# EAGLE design WSTL18P2_SHIELD (EAGLE 7.7.0)
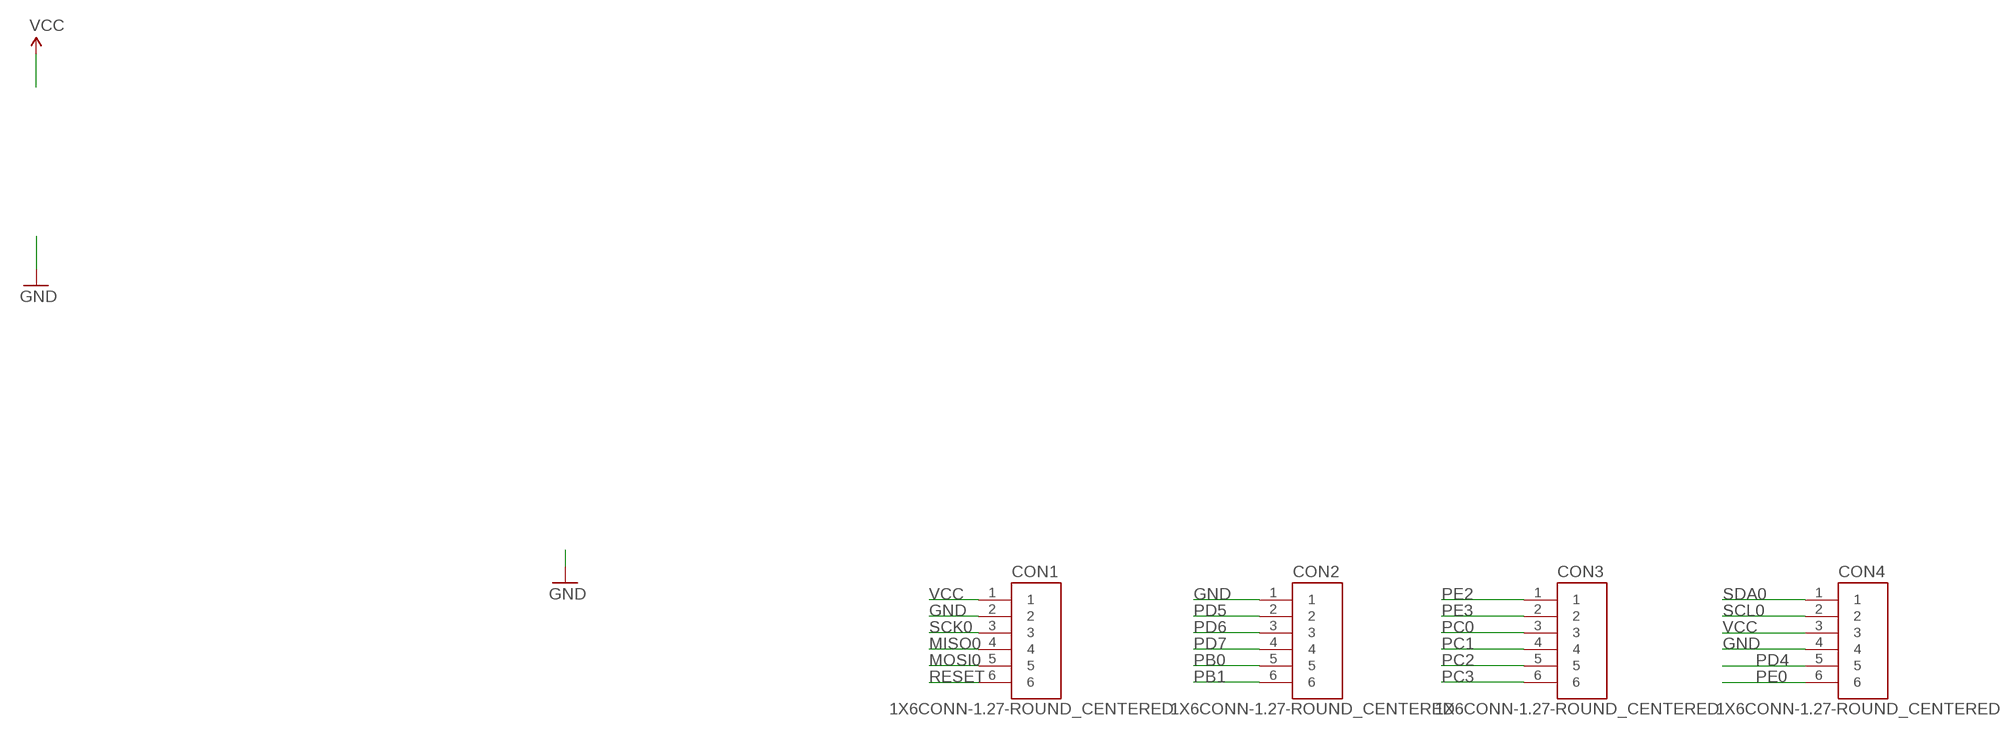
[diagram p0: schematic, sheet 1]

## Parts
CON1  1X6CONN-1.27-ROUND_CENTERED  [1X6_1.27_ROUND_CENTERED]
CON2  1X6CONN-1.27-ROUND_CENTERED  [1X6_1.27_ROUND_CENTERED]
CON3  1X6CONN-1.27-ROUND_CENTERED  [1X6_1.27_ROUND_CENTERED]
CON4  1X6CONN-1.27-ROUND_CENTERED  [1X6_1.27_ROUND_CENTERED]

## Nets
GND [GND]: CON1.2 CON2.1 CON4.4
MISO0 [Signal]: CON1.4
MOSI0 [Signal]: CON1.5
PB0: CON2.5
PB1: CON2.6
PC0: CON3.3
PC1: CON3.4
PC2: CON3.5
PC3: CON3.6
PD4: CON4.5
PD5: CON2.2
PD6: CON2.3
PD7: CON2.4
PE0: CON4.6
PE2: CON3.1
PE3: CON3.2
RESET [Signal]: CON1.6
SCK0 [Signal]: CON1.3
SCL0 [Signal]: CON4.2
SDA0 [Signal]: CON4.1
VCC: CON1.1 CON4.3

## Library data of the parts
CON1-CON4 = AVR_ISP_127:1X6CONN-1.27-ROUND_CENTERED

## Net classes
1 GND: width 0.254 mm, drill 0.305 mm, clearance 0.356 mm
2 Signal: width 0.203 mm, drill 0.305 mm, clearance 0.203 mm

## Board
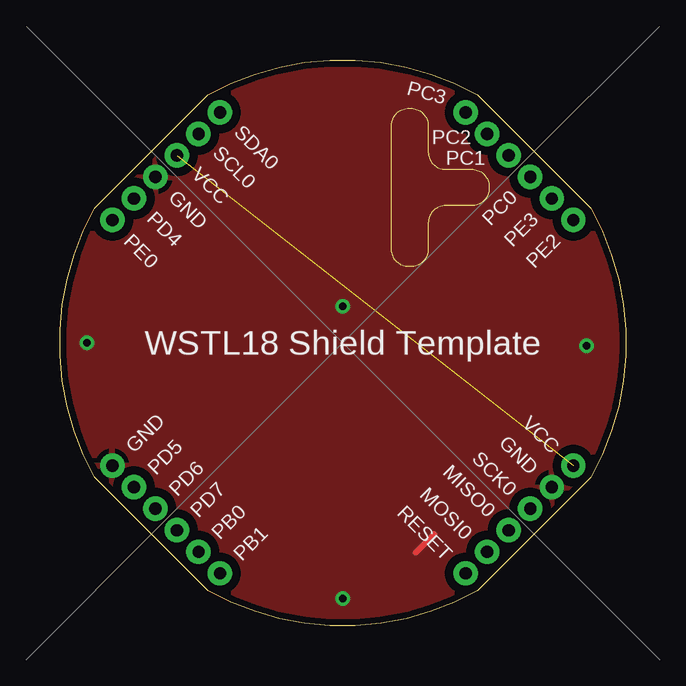
[diagram p1: board, top side]
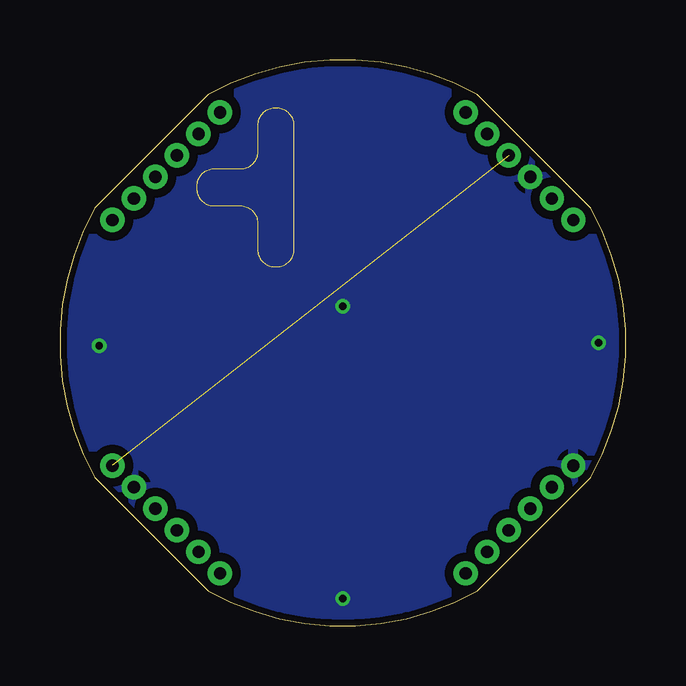
[diagram p2: board, bottom side, seen from below]

Size 23.59 x 23.59 mm. Coordinates in mm from the lower left corner, seen from the top.
Outline: 6.18,1.46 1.46,6.18 arc-59 1.46,17.41 6.18,22.13 arc-59 17.41,22.13 22.13,17.41 arc-59 22.13,6.18 17.41,1.46 arc-59 6.18,1.46
Copper layers (1*16): Top 0.035mm / dielectric 1.5mm / Bottom 0.035mm
Design rules "Nikos-SeeedStudio_2layer_DRU_no_angle_20140221": minimum track width 6mil, minimum drill 12mil, track to track 6mil, track to pad 10mil, pad to pad 10mil, via to via 10mil, smd to smd 6mil, copper to edge 10mil, drill to drill 10mil, minimum pad ring 10mil, minimum via ring 6mil, stop-mask expansion 0mil, vias tented up to drill 100mil, thermal gap 8mil
Milling: area 13.8,15 to 17.9,21.6

### Footprints (pad centres in the part's own frame; a part is rotated, then mirrored left to right if it is on the bottom)
1X6_1.27_ROUND_CENTERED = drill 0.508 pad 0.813: 1 -3.175,0; 2 -1.905,0; 3 -0.635,0; 4 0.635,0; 5 1.905,0; 6 3.175,0

### Placement (x,y rotation side)
CON1  19.16,4.43 225 top
CON2  4.43,4.43 315 top
CON3  19.16,19.16 135 top
CON4  4.43,19.16 225 top

### Tracks (layer width: path | path; a pad name or v marks a point on that pad's centre or on a via)
GND  (via drill 0.3)
  Top 0.254: 14.84,3.06 15.61,3.82
  other vias: 21.96,11.67 11.8,1.13 1.13,11.8 11.8,13.32
  pour Bottom: -1.41,-1.41 25.77,-1.41 25.77,26.4 -1.41,26.4
  pour Top: -1.41,-1.41 25.13,-1.41 25.13,26.02 -1.41,26.02
VCC  (1 unrouted)

### Text on the board
tPlace: PC3 | SDA0 | PC2 | SCL0 | PC1 | VCC | PD4 | GND | PC0 | PE3 | PE0 | PE2 | WSTL18 Shield Template | GND | VCC | PD5 | GND | PD6 | SCK0 | PD7 | MISO0 | PB0 | MOSI0 | PB1 | RESET